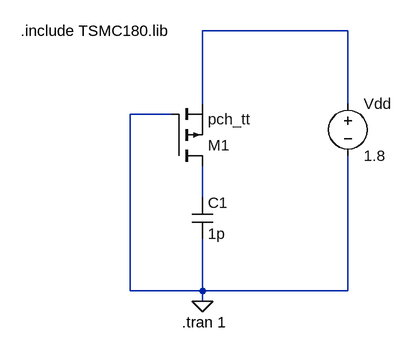
[diagram p0: schematic q1ap.asc]
q1ap.asc, the LTspice schematic file:
Version 4
SHEET 1 880 680
WIRE 448 -96 224 -96
WIRE 224 16 224 -96
WIRE 448 16 448 -96
WIRE 176 32 112 32
WIRE 224 160 224 112
WIRE 112 304 112 32
WIRE 224 304 224 224
WIRE 224 304 112 304
WIRE 448 304 448 96
WIRE 448 304 224 304
WIRE 224 320 224 304
FLAG 224 320 0
SYMBOL pmos 176 112 M180
SYMATTR InstName M1
SYMATTR Value pch_tt
SYMATTR Value2 l=180n w=240n
SYMBOL cap 208 160 R0
SYMATTR InstName C1
SYMATTR Value 1p
SYMBOL voltage 448 0 R0
SYMATTR InstName Vdd
SYMATTR Value 1.8
TEXT -56 -96 Left 2 !.include TSMC180.lib
TEXT 192 352 Left 2 !.tran 1

The netlist it stands for:
* q1ap.asc
M1 N002 0 N001 N001 pch_tt l=180n w=240n
C1 N002 0 1p
Vdd N001 0 1.8
.model NMOS NMOS
.model PMOS PMOS
.lib standard.mos
.include TSMC180.lib
.tran 1
.backanno
.end